# EAGLE design internal excitation w gp (EAGLE 6.5.0)
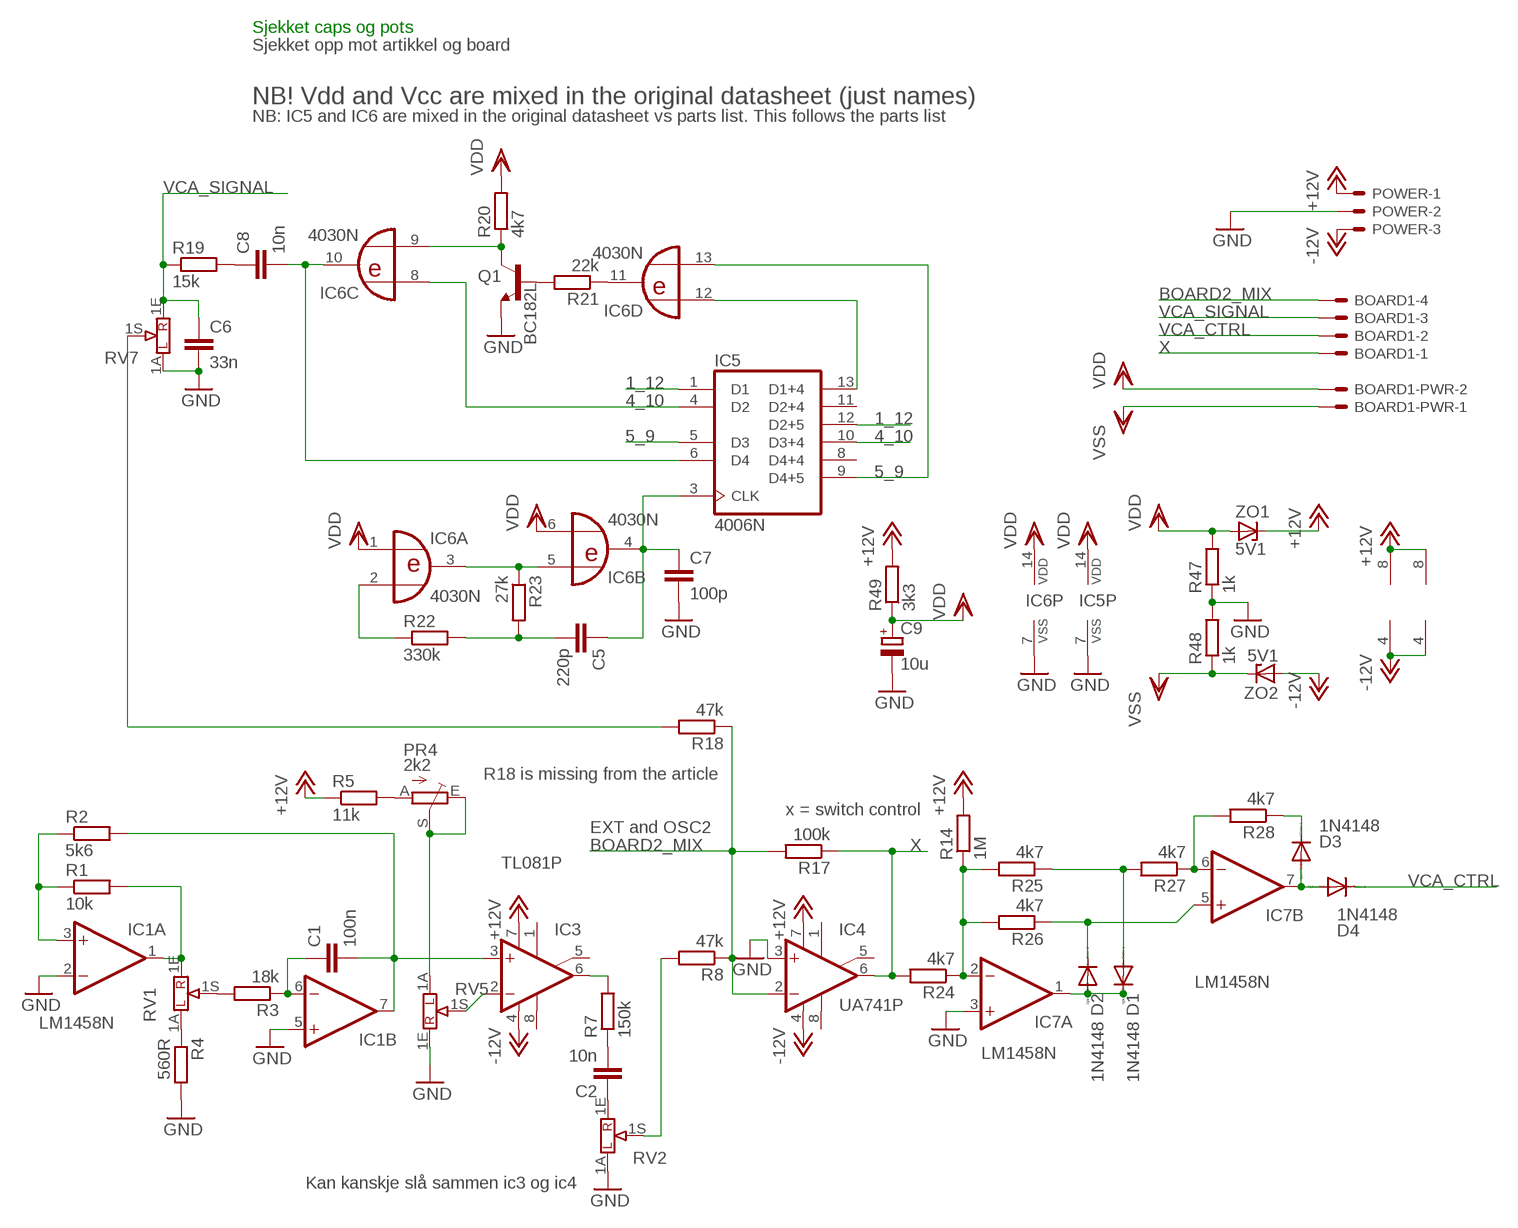
[diagram p0: schematic, sheet 1]

## Parts
BOARD1  22-23-2041  [22-23-2041]
BOARD1-PWR  22-23-2021  [22-23-2021]
C1  100n  C-EU050-030X075  [C050-030X075]
C2  10n  C-EU025-025X050  [C025-025X050]
C5  220p  C-EU025-025X050  [C025-025X050]
C6  33n  C-EU050-030X075  [C050-030X075]
C7  100p  C-EU025-025X050  [C025-025X050]
C8  10n  C-EU050-030X075  [C050-030X075]
C9  10u  CPOL-EUE2.5-5  [E2,5-5]
D1  1N4148  1N4148DOJ35-5  [DO35-5J]
D2  1N4148  1N4148DOJ35-5  [DO35-5J]
D3  1N4148  1N4148DOJ35-5  [DO35-5J]
D4  1N4148  1N4148DOJ35-5  [DO35-5J]
IC1  LM1458N  [DIL08]
IC3  TL081P  [DIL08]
IC4  UA741P  [DIL08]
IC5  4006N  [DIL14]
IC6  4030N  [DIL14]
IC7  LM1458N  [DIL08]
POWER  KK-156-3  [KK-156-3]
PR4  2k2  TRIM_EU-CA9V  [CA9V]
Q1  BC182L  -NPN-TO92-ECB  [TO92-ECB]
R1  10k  R-EU_0207/7  [0207/7]
R2  5k6  R-EU_0207/7  [0207/7]
R3  18k  R-EU_0207/7  [0207/7]
R4  560R  R-EU_0207/7  [0207/7]
R5  11k  R-EU_0207/7  [0207/7]
R7  150k  R-EU_0207/7  [0207/7]
R8  47k  R-EU_0207/7  [0207/7]
R14  1M  R-EU_0207/7  [0207/7]
R17  100k  R-EU_0207/7  [0207/7]
R18  47k  R-EU_0207/7  [0207/7]
R19  15k  R-EU_0207/7  [0207/7]
R20  4k7  R-EU_0207/7  [0207/7]
R21  22k  R-EU_0207/7  [0207/7]
R22  330k  R-EU_0207/7  [0207/7]
R23  27k  R-EU_0207/7  [0207/7]
R24  4k7  R-EU_0207/7  [0207/7]
R25  4k7  R-EU_0207/7  [0207/7]
R26  4k7  R-EU_0207/7  [0207/7]
R27  4k7  R-EU_0207/7  [0207/7]
R28  4k7  R-EU_0207/7  [0207/7]
R47  1k  R-EU_0207/7  [0207/7]
R48  1k  R-EU_0207/7  [0207/7]
R49  3k3  R-EU_0207/7  [0207/7]
RV1  10k log  POT16_W_BRACKET""  [POT16_W_BRACKET]
RV2  10k log  POT16_W_BRACKET""  [POT16_W_BRACKET]
RV5  10k  POT16_W_BRACKET""  [POT16_W_BRACKET]
RV7  10k  POT16_W_BRACKET""  [POT16_W_BRACKET]
ZO1  5V1  ZENER-DIODEZD-5  [ZDIO-5]
ZO2  5V1  ZENER-DIODEZD-5  [ZDIO-5]

## Nets
1_12: IC5.1(D1) IC5.12(D2+5)
4_10: IC5.4(D2) IC5.10(D3+4) IC6.8(C:I0)
5_9: IC5.5(D3) IC5.9(D4+5) IC6.13(D:I1)
+12V: IC1.8(P:V+) IC3.7(V+) IC4.7(V+) IC7.8(P:V+) POWER.1 R5.1 R14.2 R49.2 ZO1.C
-12V: IC1.4(P:V-) IC3.4(V-) IC4.4(V-) IC7.4(P:V-) POWER.3 ZO2.A
BOARD2_MIX: BOARD1.4 IC4.2(-IN) R8.1 R17.2 R18.1
GND: C6.2 C7.2 C9.- IC1.2(A:-IN) IC1.5(B:+IN) IC4.3(+IN) IC5.7(VSS) IC6.7(P:VSS) IC7.3(A:+IN) POWER.2 Q1.E R4.2 R47.1 R48.2 RV2.1A RV5.1E RV7.1A
N$1: IC1.3(A:+IN) R1.1 R2.1
N$2: IC1.1(A:OUT) R1.2 RV1.1E
N$3: R3.2 RV1.1S
N$4: C1.1 IC1.6(B:-IN) R3.1
N$5: R4.1 RV1.1A
N$6: C1.2 IC1.7(B:OUT) IC3.3(+IN) R2.2
N$7: IC3.2(-IN) RV5.1S
N$8: PR4.A R5.2
N$9: PR4.E PR4.S RV5.1A
N$10: IC3.6(OUT) R7.2
N$11: C2.2 R7.1
N$12: C2.1 RV2.1E
N$13: R8.2 RV2.1S
N$14: IC6.3(A:O) IC6.5(B:I0) R23.1
N$15: D1.C D2.A IC7.1(A:OUT)
N$16: IC7.2(A:-IN) R14.1 R24.1 R25.2 R26.2
N$17: D2.C IC7.5(B:+IN) R26.1
N$18: D1.A R25.1 R27.2
N$19: IC7.6(B:-IN) R27.1 R28.2
N$20: D3.C R28.1
N$21: D3.A D4.A IC7.7(B:OUT)
N$22: R18.2 RV7.1S
N$25: C8.1 R19.2
N$26: C8.2 IC5.6(D4) IC6.10(C:O)
N$27: IC6.9(C:I1) Q1.C R20.1
N$28: IC6.11(D:O) R21.1
N$29: IC6.2(A:I1) R22.1
N$30: C5.2 R22.2 R23.2
N$31: IC5.13(D1+4) IC6.12(D:I0)
N$32: C5.1 C7.1 IC5.3(CLK) IC6.4(B:O)
N$33: Q1.B R21.2
VCA_CTRL: BOARD1.2 D4.C
VCA_SIGNAL: BOARD1.3 C6.1 R19.1 RV7.1E
VDD: BOARD1-PWR.2 C9.+ IC5.14(VDD) IC6.1(A:I0) IC6.6(B:I1) IC6.14(P:VDD) R20.2 R47.2 R49.1 ZO1.A
VSS: BOARD1-PWR.1 R48.1 ZO2.C
X: BOARD1.1 IC4.6(OUT) R17.1 R24.2
Unconnected: IC3.1(ON1) IC3.5(ON2) IC3.8(OPT) IC4.1(ON1) IC4.5(ON2) IC4.8(OPT) IC5.8(D4+4) IC5.11(D2+4) RV1.M1 RV1.M2 RV1.M3 RV1.M4 RV2.M1 RV2.M2 RV2.M3 RV2.M4 RV5.M1 RV5.M2 RV5.M3 RV5.M4 RV7.M1 RV7.M2 RV7.M3 RV7.M4

## Notes on the sheet
- Sjekket caps og pots
- Sjekket opp mot artikkel og board
- NB! Vdd and Vcc are mixed in the original datasheet (just names)
- NB: IC5 and IC6 are mixed in the original datasheet vs parts list. This follows the parts list
- R18 is missing from the article
- x = switch control
- EXT and OSC2
- Kan kanskje slå sammen ic3 og ic4

## Library data of the parts
BOARD1 = con-molex:22-23-2041: .100" (2.54mm) Center Header - 4 Pin; MF: MOLEX; MPN: 22-23-2041; OC_FARNELL: 1462920; OC_NEWARK: 38C0355
BOARD1-PWR = con-molex:22-23-2021: .100" (2.54mm) Center Header - 2 Pin; MF: MOLEX; MPN: 22-23-2021; OC_FARNELL: 1462926; OC_NEWARK: 25C3832
C1 C2 C5-C8 = resistor:C-EU: CAPACITOR, European symbol
C9 = resistor:CPOL-EU: POLARIZED CAPACITOR, European symbol
D1-D4 = joakim:1N4148: DIODE high speed (Philips)
IC1 IC7 = linear:*1458: OP AMP
IC3 = linear:TL081: OP AMP
IC4 = linear:*741: OP AMP
IC5 = 40xx:4006: 18-bit static SHIFT REGISTER
IC6 = 40xx:4030: Quad XOR
POWER = con-molex:KK-156-3: KK 156 HEADER Source: http://www.molex.com/pdm_docs/sd/026604100_sd.pdf; OC_FARNELL: unknown; OC_NEWARK: unknown
PR4 = pot:TRIM_EU-: POTENTIOMETER
Q1 = transistor:*-NPN-: NPN Transistror BF959 corrected 2008.03.06
R1-R5 R7 R8 R14 R17-R28 R47-R49 = resistor:R-EU_: RESISTOR, European symbol
RV1 RV2 RV5 RV7 = joakim:POT16_W_BRACKET: POTENTIOMETER potentiometer, 16 mm w 5mm pitch and OMEG bracket, 17,8 x 7,5 mm
ZO1 ZO2 = diode:ZENER-DIODE: Z-Diode

## Board
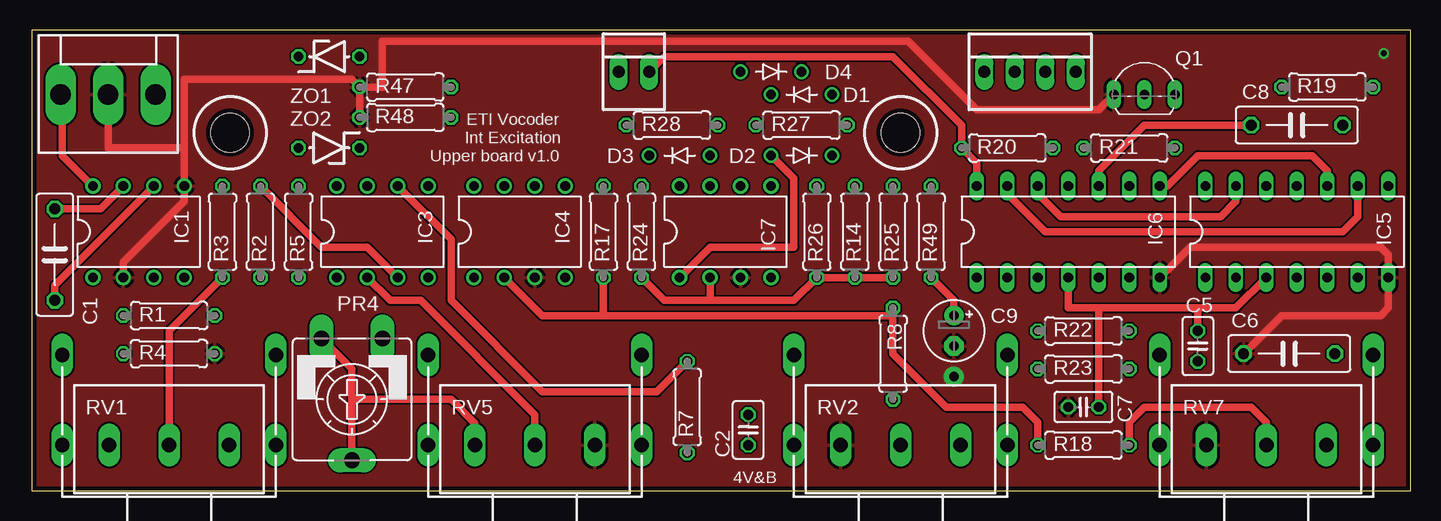
[diagram p1: board, top side]
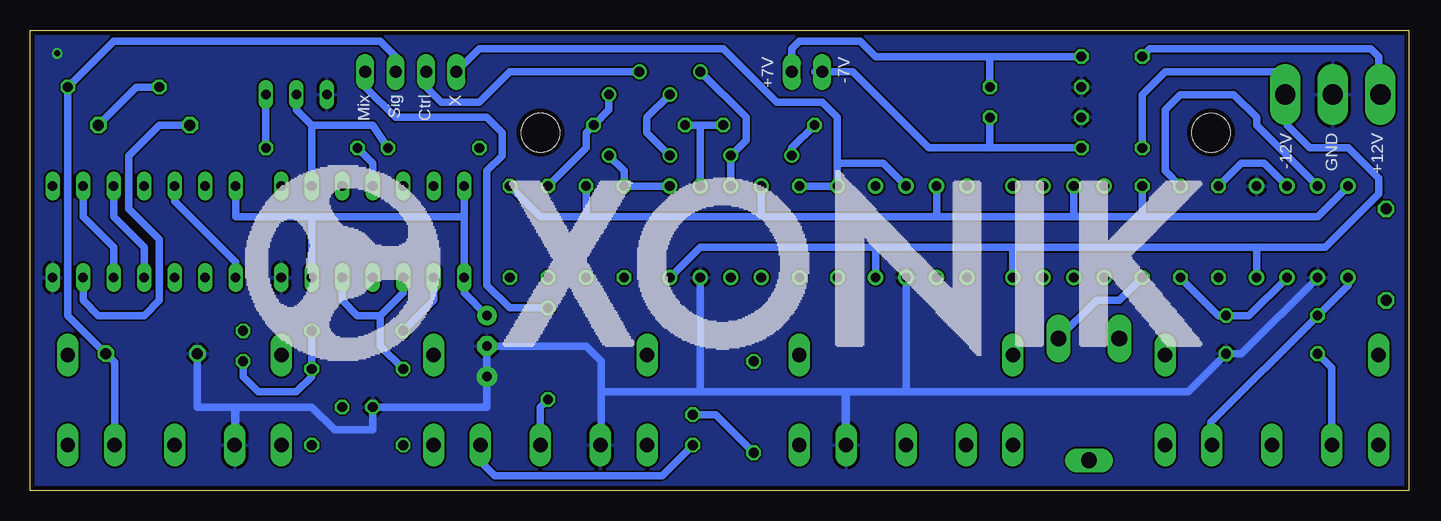
[diagram p2: board, bottom side, seen from below]

Size 114.92 x 38.41 mm. Coordinates in mm from the lower left corner, seen from the top.
Outline: 0,0 114.92,0 114.92,38.41 0,38.41 0,0
Copper layers (1*16): Top 0.0356mm / dielectric 1.5011mm / Bottom 0.0356mm
Design rules "oshpark-2layer": minimum track width 6mil, minimum drill 13mil, track to track 6mil, track to pad 6mil, pad to pad 6mil, via to via 6mil, smd to smd 6mil, copper to edge 15mil, drill to drill 6mil, minimum pad ring 7mil, minimum via ring 7mil, stop-mask expansion 2.5mil, vias tented up to drill 0mil, thermal gap 10mil
Holes 3.2 mm at 16.51,29.84 72.39,29.84

### Footprints (pad centres in the part's own frame; a part is rotated, then mirrored left to right if it is on the bottom)
22-23-2041 = drill 1 long: 1 -3.81,0; 2 -1.27,0; 3 1.27,0; 4 3.81,0
22-23-2021 = drill 1 long: 1 -1.27,0; 2 1.27,0
C075-032X103 = drill 0.914 octagon: 1 -3.81,0; 2 3.81,0
C025-025X050 = drill 0.813 octagon: 1 -1.27,0; 2 1.27,0
E2,5-5 = drill 0.813 pad 1.6: + -1.27,0 | drill 0.813 pad 1.6 octagon: - 1.27,0
DO35-5J = drill 0.813: A 2.54,0; C -2.54,0
DIL08 = drill 0.813 pad 1.27: 1 -3.81,-3.81; 2 -1.27,-3.81; 3 1.27,-3.81; 4 3.81,-3.81; 5 3.81,3.81; 6 1.27,3.81; 7 -1.27,3.81; 8 -3.81,3.81
DIL14 = drill 0.813 long: 1 -7.62,-3.81; 2 -5.08,-3.81; 3 -2.54,-3.81; 4 0,-3.81; 5 2.54,-3.81; 6 5.08,-3.81; 7 7.62,-3.81; 8 7.62,3.81; 9 5.08,3.81; 10 2.54,3.81; 11 0,3.81; 12 -2.54,3.81; 13 -5.08,3.81; 14 -7.62,3.81
KK-156-3 = drill 1.7 pad 2.184 long: 1 -3.96,0; 2 0,0; 3 3.96,0
CA9V = drill 1.321 long: A -2.54,-5.08; E 2.54,-5.08; S 0,5.08
TO92-ECB = drill 0.813 long: B 2.54,0; C 0,0; E -2.54,0
0207/7 = drill 0.813 octagon: 1 -3.81,0; 2 3.81,0
POT16_W_BRACKET = drill 1.2 long: 1A -5,0; 1E 5,0; 1S 0,0; M1 -8.9,0; M2 8.9,0; M3 8.9,7.5; M4 -8.9,7.5
ZDIO-5 = drill 0.813 octagon: A 2.54,0; C -2.54,0

### Placement (x,y rotation side)
BOARD1  83.19,34.92 0 top
BOARD1-PWR  50.16,34.92 0 top
C1  100n  [C075-032X103]  1.91,19.68 90 top
C2  59.69,5.08 90 top
C5  97.16,12.06 270 top
C6  33n  [C075-032X103]  104.78,11.43 180 top
C7  87.63,6.99 180 top
C8  10n  [C075-032X103]  105.41,30.48 180 top
C9  76.83,13.34 270 top
D1  64.14,33.02 0 top
D2  64.14,27.94 180 top
D3  53.98,27.94 0 top
D4  61.59,34.92 180 top
IC1  8.89,21.59 0 top
IC3  29.21,21.59 0 top
IC4  40.64,21.59 0 top
IC5  105.41,21.59 0 top
IC6  86.36,21.59 0 top
IC7  57.78,21.59 0 top
POWER  6.35,33.02 0 top
PR4  26.67,7.62 180 top
Q1  92.71,33.02 0 top
R1  11.43,14.61 180 top
R2  19.05,21.59 90 top
R3  15.88,21.59 270 top
R4  11.43,11.43 0 top
R5  22.23,21.59 270 top
R7  54.61,6.99 90 top
R8  71.75,11.43 270 top
R14  68.58,21.59 90 top
R17  47.62,21.59 270 top
R18  87.63,3.81 0 top
R19  107.95,33.66 180 top
R20  81.28,28.57 180 top
R21  91.44,28.57 0 top
R22  87.63,13.34 0 top
R23  87.63,10.16 0 top
R24  50.8,21.59 90 top
R25  71.75,21.59 270 top
R26  65.41,21.59 270 top
R27  64.14,30.48 0 top
R28  53.34,30.48 0 top
R47  31.11,33.66 0 top
R48  31.11,31.11 180 top
R49  74.93,21.59 90 top
RV1  11.43,3.81 0 top
RV2  72.39,3.81 0 top
RV5  41.91,3.81 0 top
RV7  102.87,3.81 0 top
ZO1  24.77,36.2 0 top
ZO2  24.77,28.57 180 top

### Tracks (layer width: path | path; a pad name or v marks a point on that pad's centre or on a via)
1_12
  Bottom 0.61: IC5.12 102.87,24.13 97.79,19.05 IC5.1
4_10
  Top 0.61: IC6.8 94.61,25.4 97.16,27.94 106.68,27.94 107.95,26.67 IC5.10
  Bottom 0.61: IC5.10 107.95,22.86 105.41,20.32 IC5.4
5_9
  Top 0.61: IC6.13 81.28,24.77 84.45,21.59 109.22,21.59 110.49,22.86 IC5.9
  Bottom 0.61: IC5.9 110.49,22.86 107.95,20.32 IC5.5
+12V
  Top 0.61: IC1.8 2.54,27.94 2.54,32.87 POWER.1
  Bottom 0.61: IC1.8 7.62,22.86 22.23,22.86 | 22.23,22.86 27.94,22.86 | 27.94,22.86 39.37,22.86 | IC3.7 27.94,22.86 | R5.1 22.23,22.86 | IC4.7 39.37,22.86 | 39.37,22.86 53.98,22.86 | IC7.8 53.98,22.86 | 53.98,22.86 68.58,22.86 | R14.2 68.58,22.86 | 68.58,22.86 72.39,22.86 R49.2 | ZO1.C 21.59,36.83 3.17,36.83 2.54,36.2 2.54,33.8 POWER.1 2.54,32.87
-12V
  Bottom 0.61: IC1.4 12.7,20.32 | 12.7,20.32 6.99,20.32 2.54,24.77 2.54,26.04 5.08,28.57 8.26,28.57 10.16,30.48 10.16,32.87 | IC3.4 33.02,20.32 | 33.02,20.32 12.7,20.32 | 33.02,20.32 44.45,20.32 | IC4.4 44.45,20.32 | 44.45,20.32 59.05,20.32 IC7.4 | ZO2.A 22.23,33.02 20.32,34.92 10.16,34.92 10.16,32.87 | 10.16,32.87 POWER.3
BOARD2_MIX
  Top 0.61: 71.75,14.61 71.75,11.43 76.2,6.99 82.55,6.99 83.82,5.71 R18.1 | IC4.2 42.55,14.61 47.62,14.61 | R17.2 47.62,14.61 | 47.62,14.61 71.75,14.61 | 71.75,14.61 R8.1
  Bottom 0.61: BOARD1.4 87,33.66 84.45,31.11 76.83,31.11 75.56,29.84 75.56,27.94 76.83,26.67 76.83,17.14 74.93,15.24 R8.1
GND  (via drill 0.5, 0.8 pad 1.68)
  Top 0.61: IC1.2 7.62,19.05 12.7,24.13 IC1.5 12.7,28.57 | 12.7,28.57 6.35,28.57 POWER.2 | 12.7,28.57 12.7,34.29 26.67,34.29 R47.1 | R47.1 R48.2 | Q1.E 88.9,31.75 78.74,31.75 73.03,37.47 29.21,37.47 29.21,33.66 R47.1 | IC6.7 96.52,20.32 112.39,20.32 113.03,19.68 IC5.7 113.03,15.24 112.39,14.61 104.14,14.61 C6.2
  Bottom 0.61: IC1.2 13.97,11.43 R4.2 18.41,8.26 41.91,8.26 | 41.91,8.26 46.99,8.26 | 46.99,8.26 46.99,3.89 RV5.1E 46.91,8.18 46.99,8.26 | 46.99,8.26 59.05,8.26 | 59.05,8.26 67.31,8.26 | 67.31,8.26 67.31,3.89 RV2.1A | RV7.1A 97.87,4.53 | 97.87,4.53 97.79,4.53 97.79,6.99 | 97.79,6.99 100.97,6.99 C6.2 | 97.87,4.53 97.87,6.91 97.79,6.99 | 97.79,6.99 91.44,6.99 89.53,5.08 86.36,5.08 C7.2 76.83,6.99 v76.83,9.53 C9.- 68.58,12.06 67.31,10.79 67.31,8.26 | IC4.3 41.91,8.26 | IC7.3 59.05,8.26
  other vias: 112.65,36.45
  pour Top: -0.38,39.24 -0.38,-0.51 115.19,-0.51 115.19,39.24
  pour Bottom: -1.14,40.01 -1.14,-1.02 114.94,-1.02 114.94,40.01
N$1
  Bottom 0.61: IC1.3 13.34,14.61 R1.1 15.88,14.61 R2.1
N$2
  Bottom 0.61: IC1.1 5.08,17.14 R1.2 16.51,5.71 16.51,3.89 RV1.1E
N$3
  Top 0.61: RV1.1S 11.43,13.34 R3.2
N$4
  Top 0.61: C1.1 1.91,17.14 IC1.6
  Bottom 0.61: IC1.6 12.06,27.3 13.97,27.3 R3.1
N$5
  Bottom 0.61: RV1.1A 6.43,10.24 R4.1
N$6
  Top 0.61: R2.2 24.13,20.32 27.94,20.32 IC3.3 | C1.2 5.71,23.5 IC1.7
  Bottom 0.61: R2.2 20.32,26.67 20.32,31.75 19.05,33.02 14.61,33.02 12.7,31.11 12.7,30.48 IC1.7
N$7
  Top 0.61: IC3.2 29.84,15.88 32.38,15.88 41.91,6.35 RV5.1S
N$8
  Bottom 0.61: R5.2 24.13,15.88 26.04,15.88 PR4.A
N$9
  Top 0.61: RV5.1A 36.91,5.63 34.92,7.62 26.67,7.62 | 26.67,7.62 PR4.S | PR4.E 26.67,10.16 26.67,7.62
N$10
  Top 0.61: R7.2 52.07,8.26 42.55,8.26 34.92,15.88 34.92,20.95 IC3.6
N$11
  Bottom 0.61: C2.2 57.78,6.35 R7.1
N$12
  Bottom 0.61: RV2.1E 77.39,2.46 76.2,1.27 62.23,1.27 C2.1
N$13
  Bottom 0.61: RV2.1S 72.39,6.99 R8.2
N$14
  Bottom 0.61: R23.1 85.72,12.06 85.72,14.61 | IC6.3 83.82,16.51 85.72,14.61 | 85.72,14.61 87.63,14.61 88.9,15.88 IC6.5
N$15
  Top 0.61: IC7.1 56.52,20.32 63.5,20.32 63.5,26.04 D2.A
  Bottom 0.61: D2.A 63.5,29.84 63.5,31.11 D1.C
N$16
  Top 0.61: R24.1 52.7,15.88 56.52,15.88 | 56.52,15.88 63.5,15.88 R26.2 R14.1 R25.2 | IC7.2 56.52,15.88
N$17
  Bottom 0.61: IC7.5 R26.1 65.41,26.67 D2.C
N$18
  Bottom 0.61: D1.A 66.67,31.75 R27.2 68.58,29.84 68.58,28.57 R25.1
N$19
  Bottom 0.61: IC7.6 59.05,30.48 R28.2 R27.1
N$20
  Bottom 0.61: R28.1 51.44,28.57 D3.C
N$21
  Bottom 0.61: IC7.7 D3.A 55.24,29.21 55.24,31.11 D4.A
N$22
  Top 0.61: R18.2 91.44,5.71 92.71,6.99 101.6,6.99 102.87,5.71 RV7.1S
N$25
  Bottom 0.61: R19.2 106.05,33.66 C8.1
N$26
  Top 0.61: IC6.10 88.9,26.67 92.71,30.48 C8.2
  Bottom 0.61: C8.2 104.14,30.48 106.68,27.94 106.68,23.5 104.14,20.95 104.14,15.88 105.41,14.61 109.22,14.61 110.49,15.88 IC5.6
N$27
  Bottom 0.61: Q1.C 92.71,31.75 91.44,30.48 | 91.44,30.48 IC6.9 | R20.1 86.36,30.48 91.44,30.48
N$28
  Bottom 0.61: IC6.11 86.36,27.3 R21.1
N$29
  Bottom 0.61: IC6.2 81.28,15.88 R22.1
N$30
  Bottom 0.61: R22.2 R23.2 91.44,9.53 92.71,8.26 95.89,8.26 97.16,9.53 C5.2
N$31
  Top 0.61: IC5.13 100.33,24.13 99.06,22.86 85.72,22.86 83.82,24.77 IC6.12
N$32
  Top 0.61: IC6.4 86.36,15.24 88.9,15.24 | 88.9,15.24 97.16,15.24 | 97.16,15.24 100.33,15.24 IC5.3 | C5.1 97.16,15.24 | C7.1 88.9,15.24
N$33
  Bottom 0.61: R21.2 Q1.B
VCA_CTRL
  Bottom 0.61: D4.C 74.93,34.92 77.47,32.38 80.64,32.38 81.92,33.66 BOARD1.2
VCA_SIGNAL
  Bottom 0.61: RV7.1E 107.87,10.71 C6.1 111.76,14.61 R19.1 107.95,37.47 85.72,37.47 84.45,36.2 BOARD1.3
VDD
  Top 0.61: R49.1 76.83,15.88 C9.+ | BOARD1-PWR.2 52.7,36.2 71.75,36.2 77.47,30.48 R20.2 78.74,27.3 IC6.14
  Bottom 0.61: IC5.14 97.79,22.86 91.44,22.86 | 91.44,22.86 78.74,22.86 | IC6.14 78.74,22.86 | 78.74,22.86 IC6.1 78.74,16.51 C9.+ | IC6.6 91.44,22.86 | ZO1.A 34.92,36.2 | 34.92,36.2 44.45,36.2 45.72,37.47 50.8,37.47 51.44,36.83 BOARD1-PWR.2 | R47.2 34.92,36.2
VSS
  Bottom 0.61: ZO2.C 34.92,28.57 | 34.92,28.57 40.01,28.57 46.35,34.92 BOARD1-PWR.1 49.53,34.92 | R48.1 34.92,28.57
X
  Bottom 0.61: IC4.6 43.81,27.3 47.62,27.3 | R24.2 R17.1 47.62,27.3 | 47.62,27.3 47.62,31.11 48.9,32.38 52.7,32.38 57.15,36.83 77.47,36.83 BOARD1.1

### Text on the board
tNames: ETI Vocoder | Int Excitation | Upper board v1.0 | 4V&B
bNames: -7V | +7V | X | Ctrl | Sig | Mix | +12V | GND | -12V